# EAGLE design Beta24_SMD (EAGLE 9.4.2)
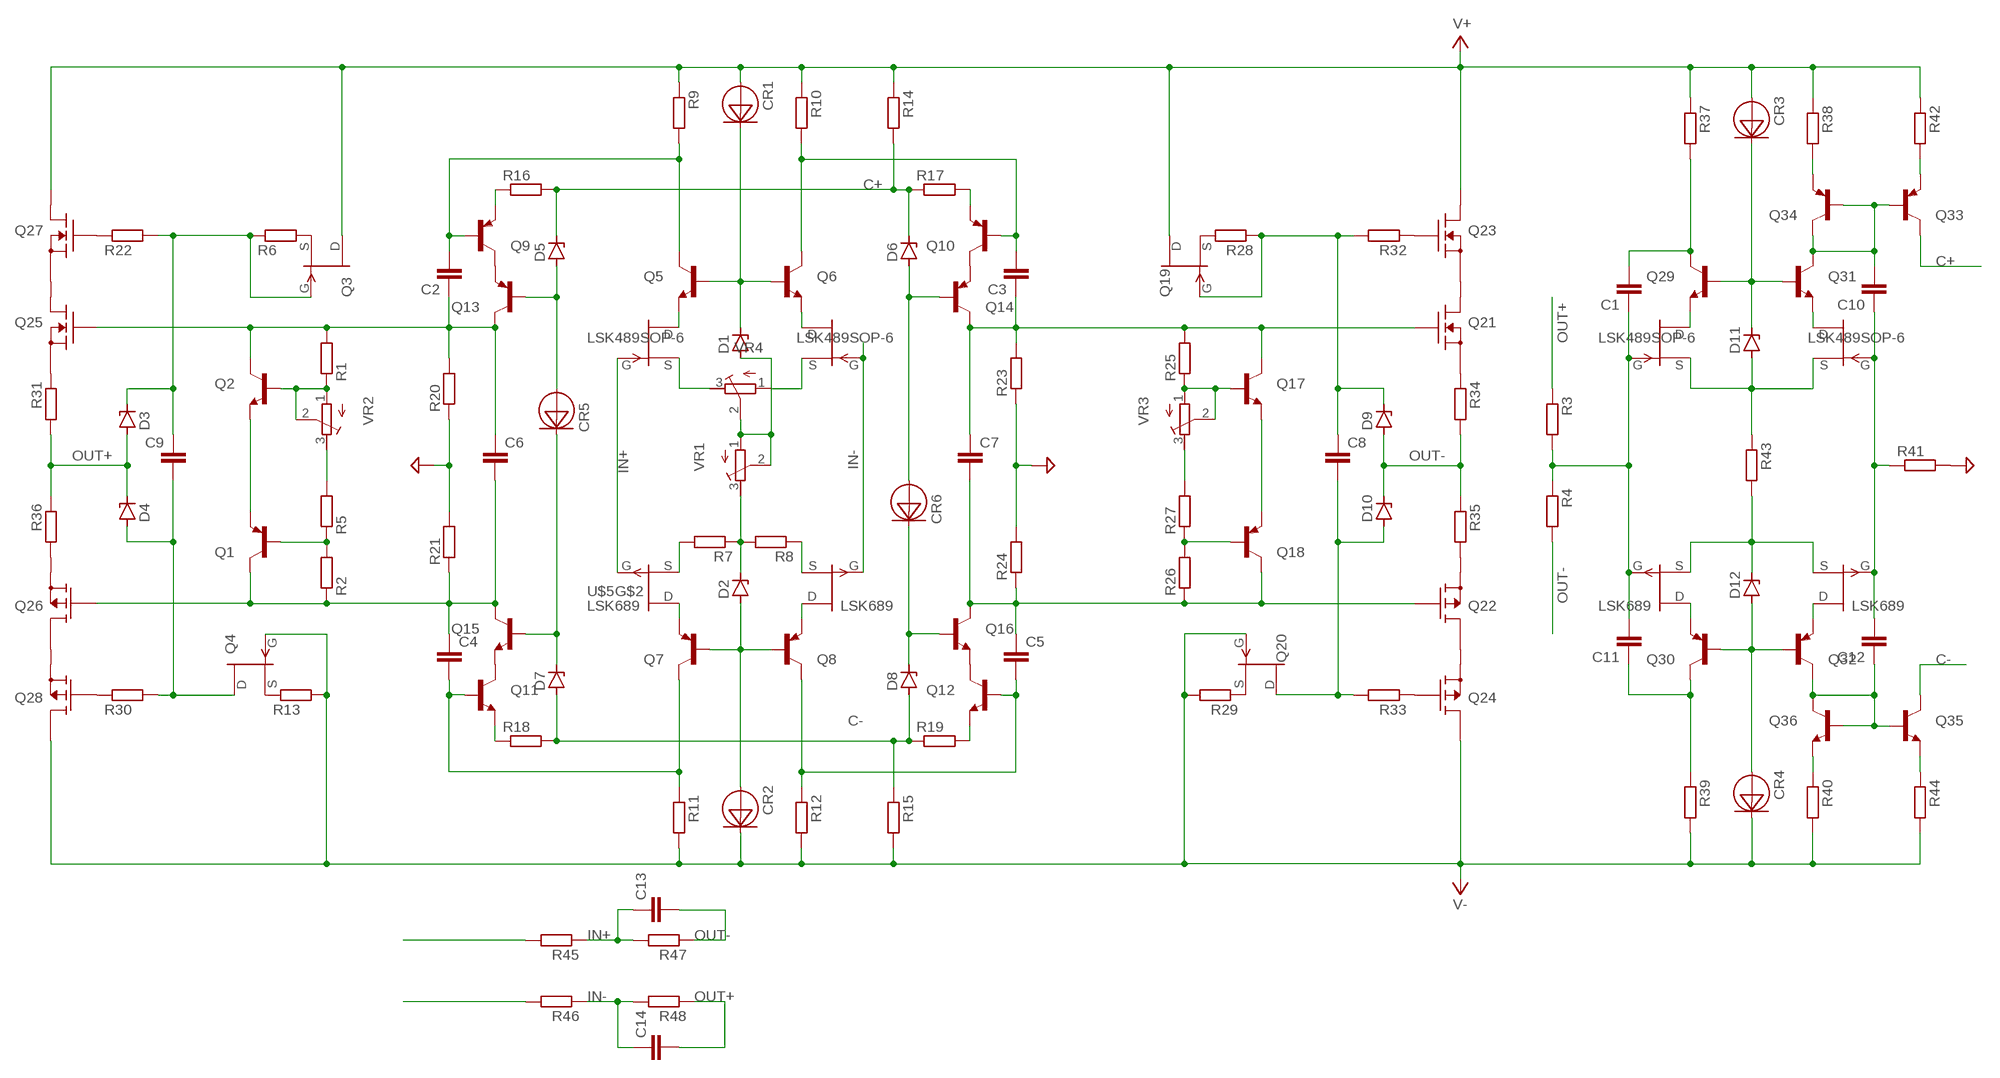
[diagram p0: schematic, sheet 1]

## Parts
C1  C-EUC1206  [C1206]
C2  C-EUC1206  [C1206]
C3  C-EUC1206  [C1206]
C4  C-EUC1206  [C1206]
C5  C-EUC1206  [C1206]
C6  C-EUC1206  [C1206]
C7  C-EUC1206  [C1206]
C8  C-EUC1206  [C1206]
C9  C-EUC1206  [C1206]
C10  C-EUC1206  [C1206]
C11  C-EUC1206  [C1206]
C12  C-EUC1206  [C1206]
C13  C-EUC1206  [C1206]
C14  C-EUC1206  [C1206]
CR1  1N5283  [SMD]
CR2  1N5283  [SMD]
CR3  1N5283  [SMD]
CR4  1N5283  [SMD]
CR5  1N5283  [SMD]
CR6  1N5283  [SMD]
D1  ZENER-DIODESOD80C  [SOD80C]
D2  ZENER-DIODESOD80C  [SOD80C]
D3  ZENER-DIODESOD80C  [SOD80C]
D4  ZENER-DIODESOD80C  [SOD80C]
D5  ZENER-DIODESOD80C  [SOD80C]
D6  ZENER-DIODESOD80C  [SOD80C]
D7  ZENER-DIODESOD80C  [SOD80C]
D8  ZENER-DIODESOD80C  [SOD80C]
D9  ZENER-DIODESOD80C  [SOD80C]
D10  ZENER-DIODESOD80C  [SOD80C]
D11  ZENER-DIODESOD80C  [SOD80C]
D12  ZENER-DIODESOD80C  [SOD80C]
Q1  TRANSISTOR_BC858C-PNP-SOT23-BEC  [TRANSISTOR_SOT23-BEC]
Q2  TRANSISTOR_BC850-NPN-SOT23-BEC  [TRANSISTOR_SOT23-BEC]
Q3  SST5486  [SOT23]
Q4  SST5486  [SOT23]
Q5  TRANSISTOR_BC850-NPN-SOT23-BEC  [TRANSISTOR_SOT23-BEC]
Q6  TRANSISTOR_BC850-NPN-SOT23-BEC  [TRANSISTOR_SOT23-BEC]
Q7  TRANSISTOR_BC858C-PNP-SOT23-BEC  [TRANSISTOR_SOT23-BEC]
Q8  TRANSISTOR_BC858C-PNP-SOT23-BEC  [TRANSISTOR_SOT23-BEC]
Q9  TRANSISTOR_BC858C-PNP-SOT23-BEC  [TRANSISTOR_SOT23-BEC]
Q10  TRANSISTOR_BC858C-PNP-SOT23-BEC  [TRANSISTOR_SOT23-BEC]
Q11  TRANSISTOR_BC850-NPN-SOT23-BEC  [TRANSISTOR_SOT23-BEC]
Q12  TRANSISTOR_BC850-NPN-SOT23-BEC  [TRANSISTOR_SOT23-BEC]
Q13  TRANSISTOR_BC858C-PNP-SOT23-BEC  [TRANSISTOR_SOT23-BEC]
Q14  TRANSISTOR_BC858C-PNP-SOT23-BEC  [TRANSISTOR_SOT23-BEC]
Q15  TRANSISTOR_BC850-NPN-SOT23-BEC  [TRANSISTOR_SOT23-BEC]
Q16  TRANSISTOR_BC850-NPN-SOT23-BEC  [TRANSISTOR_SOT23-BEC]
Q17  TRANSISTOR_BC850-NPN-SOT23-BEC  [TRANSISTOR_SOT23-BEC]
Q18  TRANSISTOR_BC858C-PNP-SOT23-BEC  [TRANSISTOR_SOT23-BEC]
Q19  SST5486  [SOT23]
Q20  SST5486  [SOT23]
Q21  IRFZ24N  [TO220V]
Q22  IRFZ34N  [TO220V]
Q23  IRFZ24N  [TO220V]
Q24  IRFZ34N  [TO220V]
Q25  IRFZ24N  [TO220V]
Q26  IRFZ34N  [TO220V]
Q27  IRFZ24N  [TO220V]
Q28  IRFZ34N  [TO220V]
Q29  TRANSISTOR_BC850-NPN-SOT23-BEC  [TRANSISTOR_SOT23-BEC]
Q30  TRANSISTOR_BC858C-PNP-SOT23-BEC  [TRANSISTOR_SOT23-BEC]
Q31  TRANSISTOR_BC850-NPN-SOT23-BEC  [TRANSISTOR_SOT23-BEC]
Q32  TRANSISTOR_BC858C-PNP-SOT23-BEC  [TRANSISTOR_SOT23-BEC]
Q33  TRANSISTOR_BC858C-PNP-SOT23-BEC  [TRANSISTOR_SOT23-BEC]
Q34  TRANSISTOR_BC858C-PNP-SOT23-BEC  [TRANSISTOR_SOT23-BEC]
Q35  TRANSISTOR_BC850-NPN-SOT23-BEC  [TRANSISTOR_SOT23-BEC]
Q36  TRANSISTOR_BC850-NPN-SOT23-BEC  [TRANSISTOR_SOT23-BEC]
R1  R-EU_MELF0204W  [MINI_MELF-0204W]
R2  R-EU_MELF0204W  [MINI_MELF-0204W]
R3  R-EU_MELF0204W  [MINI_MELF-0204W]
R4  R-EU_MELF0204W  [MINI_MELF-0204W]
R5  R-EU_MELF0204W  [MINI_MELF-0204W]
R6  R-EU_MELF0204W  [MINI_MELF-0204W]
R7  R-EU_MELF0204W  [MINI_MELF-0204W]
R8  R-EU_MELF0204W  [MINI_MELF-0204W]
R9  R-EU_MELF0204W  [MINI_MELF-0204W]
R10  R-EU_MELF0204W  [MINI_MELF-0204W]
R11  R-EU_MELF0204W  [MINI_MELF-0204W]
R12  R-EU_MELF0204W  [MINI_MELF-0204W]
R13  R-EU_MELF0204W  [MINI_MELF-0204W]
R14  R-EU_MELF0204W  [MINI_MELF-0204W]
R15  R-EU_MELF0204W  [MINI_MELF-0204W]
R16  R-EU_MELF0204W  [MINI_MELF-0204W]
R17  R-EU_MELF0204W  [MINI_MELF-0204W]
R18  R-EU_MELF0204W  [MINI_MELF-0204W]
R19  R-EU_MELF0204W  [MINI_MELF-0204W]
R20  R-EU_MELF0204W  [MINI_MELF-0204W]
R21  R-EU_MELF0204W  [MINI_MELF-0204W]
R22  R-EU_MELF0204W  [MINI_MELF-0204W]
R23  R-EU_MELF0204W  [MINI_MELF-0204W]
R24  R-EU_MELF0204W  [MINI_MELF-0204W]
R25  R-EU_MELF0204W  [MINI_MELF-0204W]
R26  R-EU_MELF0204W  [MINI_MELF-0204W]
R27  R-EU_MELF0204W  [MINI_MELF-0204W]
R28  R-EU_MELF0204W  [MINI_MELF-0204W]
R29  R-EU_MELF0204W  [MINI_MELF-0204W]
R30  R-EU_MELF0204W  [MINI_MELF-0204W]
R31  R-EU_0617/17  [0617/17]
R32  R-EU_MELF0204W  [MINI_MELF-0204W]
R33  R-EU_MELF0204W  [MINI_MELF-0204W]
R34  R-EU_0617/17  [0617/17]
R35  R-EU_0617/17  [0617/17]
R36  R-EU_0617/17  [0617/17]
R37  R-EU_MELF0204W  [MINI_MELF-0204W]
R38  R-EU_MELF0204W  [MINI_MELF-0204W]
R39  R-EU_MELF0204W  [MINI_MELF-0204W]
R40  R-EU_MELF0204W  [MINI_MELF-0204W]
R41  R-EU_MELF0204W  [MINI_MELF-0204W]
R42  R-EU_MELF0204W  [MINI_MELF-0204W]
R43  R-EU_MELF0204W  [MINI_MELF-0204W]
R44  R-EU_MELF0204W  [MINI_MELF-0204W]
R45  R-EU_MELF0204W  [MINI_MELF-0204W]
R46  R-EU_MELF0204W  [MINI_MELF-0204W]
R47  R-EU_MELF0204W  [MINI_MELF-0204W]
R48  R-EU_MELF0204W  [MINI_MELF-0204W]
U$1  LSK489SOP-6  [SOT-23-6]
U$3  LSK489SOP-6  [SOT-23-6]
U$4  LSK689  [SOT-23-6]
U$5  LSK689  [SOT-23-6]
VR1  R-TRIMM3296W  [RTRIM3296W]
VR2  R-TRIMM3296W  [RTRIM3296W]
VR3  R-TRIMM3296W  [RTRIM3296W]
VR4  R-TRIMM3296W  [RTRIM3296W]

## Nets
C+: D5.C D6.C Q33.C R14.2 R16.2 R17.1
C-: D7.A D8.A Q35.C R15.1 R18.2 R19.1
GND: R20.1 R21.2 R23.1 R24.2 R41.2
IN+: C13.1 R45.1 R47.2 U$1.1(G) U$5.4(G)
IN-: C14.1 R46.1 R48.2 U$1.4(G) U$5.1(G)
N$1: C12.1 Q32.C Q35.B Q36.B Q36.C
N$2: Q6.E U$1.5(D)
N$3: U$1.3(S) VR4.3(E)
N$4: R7.2 U$5.6(S)
N$5: Q5.E U$1.2(D)
N$6: Q7.E U$5.5(D)
N$7: U$1.6(S) VR4.1(A)
N$8: D2.C R7.1 R8.2 VR1.3(E)
N$9: R8.1 U$5.3(S)
N$10: Q8.E U$5.2(D)
N$11: D1.A VR1.1(A) VR1.2(S) VR4.2(S)
N$12: CR2.ANODE D2.A Q7.B Q8.B
N$13: C2.2 Q5.C Q9.B R9.2
N$14: C3.2 Q6.C Q10.B R10.2
N$15: C3.1 C7.1 Q14.C Q17.C Q21.1(G) R23.2 R25.2
N$16: CR1.CATHODE D1.C Q5.B Q6.B
N$17: Q36.E R40.1
N$18: C5.2 Q8.C Q12.B R12.1
N$19: C1.1 C11.2 R3.2 R4.1 U$3.1(G) U$4.1(G)
N$20: C8.2 D10.A Q20.1(D) R33.2
N$21: D12.C R43.2 U$4.3(S) U$4.6(S)
N$22: D11.A R43.1 U$3.3(S) U$3.6(S)
N$23: Q9.C Q13.E
N$24: C4.2 Q7.C Q11.B R11.1
N$25: Q10.C Q14.E
N$26: Q34.E R38.2
N$27: Q9.E R16.1
N$28: Q10.E R17.2
N$29: C10.2 Q31.C Q33.B Q34.B Q34.C
N$30: Q11.E R18.1
N$31: Q12.E R19.2
N$32: R45.2
N$33: Q31.E U$3.5(D)
N$34: CR4.ANODE D12.A Q30.B Q32.B
N$35: C2.1 C6.1 Q2.C Q13.C Q25.1(G) R1.2 R20.2
N$36: C4.1 C6.2 Q1.C Q15.C Q26.1(G) R2.1 R21.1
N$37: Q11.C Q15.E
N$38: Q12.C Q16.E
N$39: Q17.B R25.1 VR3.1(A) VR3.2(S)
N$40: Q19.2(S) R28.2
N$41: Q20.2(S) R29.1
N$42: C1.2 Q29.C R37.2
N$43: CR5.ANODE D5.A Q13.B
N$44: CR6.ANODE D6.A Q14.B
N$45: CR5.CATHODE D7.C Q15.B
N$46: CR6.CATHODE D8.C Q16.B
N$47: Q18.B R26.2 R27.1
N$48: R27.2 VR3.3(E)
N$49: Q17.E Q18.E
N$50: C5.1 C7.2 Q16.C Q18.C Q22.1(G) R24.1 R26.1
N$51: Q1.B R2.2 R5.1
N$52: Q1.E Q2.E
N$53: Q35.E R44.1
N$54: C8.1 D9.C Q19.3(G) R28.1 R32.2
N$55: Q3.2(S) R6.2
N$56: Q4.2(S) R13.1
N$57: Q21.2(D) Q23.3(S)
N$58: Q22.2(D) Q24.3(S)
N$59: Q23.1(G) R32.1
N$60: Q24.1(G) R33.1
N$61: C9.1 D3.C Q3.3(G) R6.1 R22.2
N$62: Q21.3(S) R34.1
N$63: Q22.3(S) R35.2
N$64: C9.2 D4.A Q4.1(D) R30.2
N$65: Q25.2(D) Q27.3(S)
N$66: Q26.2(D) Q28.3(S)
N$67: Q27.1(G) R22.1
N$68: Q28.1(G) R30.1
N$69: Q25.3(S) R31.1
N$70: Q26.3(S) R36.2
N$71: Q2.B R1.1 VR2.1(A) VR2.2(S)
N$72: R5.2 VR2.3(E)
N$73: CR3.CATHODE D11.C Q29.B Q31.B
N$75: Q29.E U$3.2(D)
N$76: C10.1 C12.2 R41.1 U$3.4(G) U$4.4(G)
N$77: Q30.E U$4.2(D)
N$79: Q32.E U$4.5(D)
N$80: C11.1 Q30.C R39.1
N$81: Q33.E R42.2
N$82: R46.2
OUT+: C14.2 D3.A D4.C R3.1 R31.2 R36.1 R48.1
OUT-: C13.2 D9.A D10.C R4.2 R34.2 R35.1 R47.1
V+: CR1.ANODE CR3.ANODE Q3.1(D) Q19.1(D) Q23.2(D) Q27.2(D) R9.1 R10.1 R14.1 R37.1 R38.1 R42.1
V-: CR2.CATHODE CR4.CATHODE Q4.3(G) Q20.3(G) Q24.2(D) Q28.2(D) R11.2 R12.2 R13.2 R15.2 R29.2 R39.2 R40.2 R44.2

## Library data of the parts
C1-C14 = Vwvwbg:C-EU: CAPACITOR, European symbol
CR1-CR6 = crd:1N5283: 0.22 mA through 4.23 mA current regulating diode series
D1-D12 = diode:ZENER-DIODE: Z-Diode
Q1 Q7-Q10 Q13 Q14 Q18 Q30 Q32-Q34 = Vwvwbg:TRANSISTOR_*-PNP-: PNP Transistror
Q2 Q5 Q6 Q11 Q12 Q15-Q17 Q29 Q31 Q35 Q36 = Vwvwbg:TRANSISTOR_*-NPN-: NPN Transistror BF959 corrected 2008.03.06
Q3 Q4 Q19 Q20 = transistor-fet:?548*: N-Channel JFETs Source: VISHAY 2N5484.pdf Compatible: TO92 2N5245 J304 J305 U310 J308 J309 J310 TO72 2N4416 2N4416A 2N3823 2N4351 3N169 3N170 3N171 MFE3002 TO18 2N3796 2N3797 MFE825 Source: Motorola European Master Guide Pacge 3-59
Q21 Q23 Q25 Q27 = transistor-fet:IRFZ24N
Q22 Q24 Q26 Q28 = transistor-fet:IRFZ34N
R1-R48 = Vwvwbg:R-EU_: RESISTOR, European symbol
U$1 U$3 = Vwvwbg:LSK489
U$4 U$5 = Vwvwbg:LSK689
VR1-VR4 = resistor:R-TRIMM: Trimm resistor

## Board
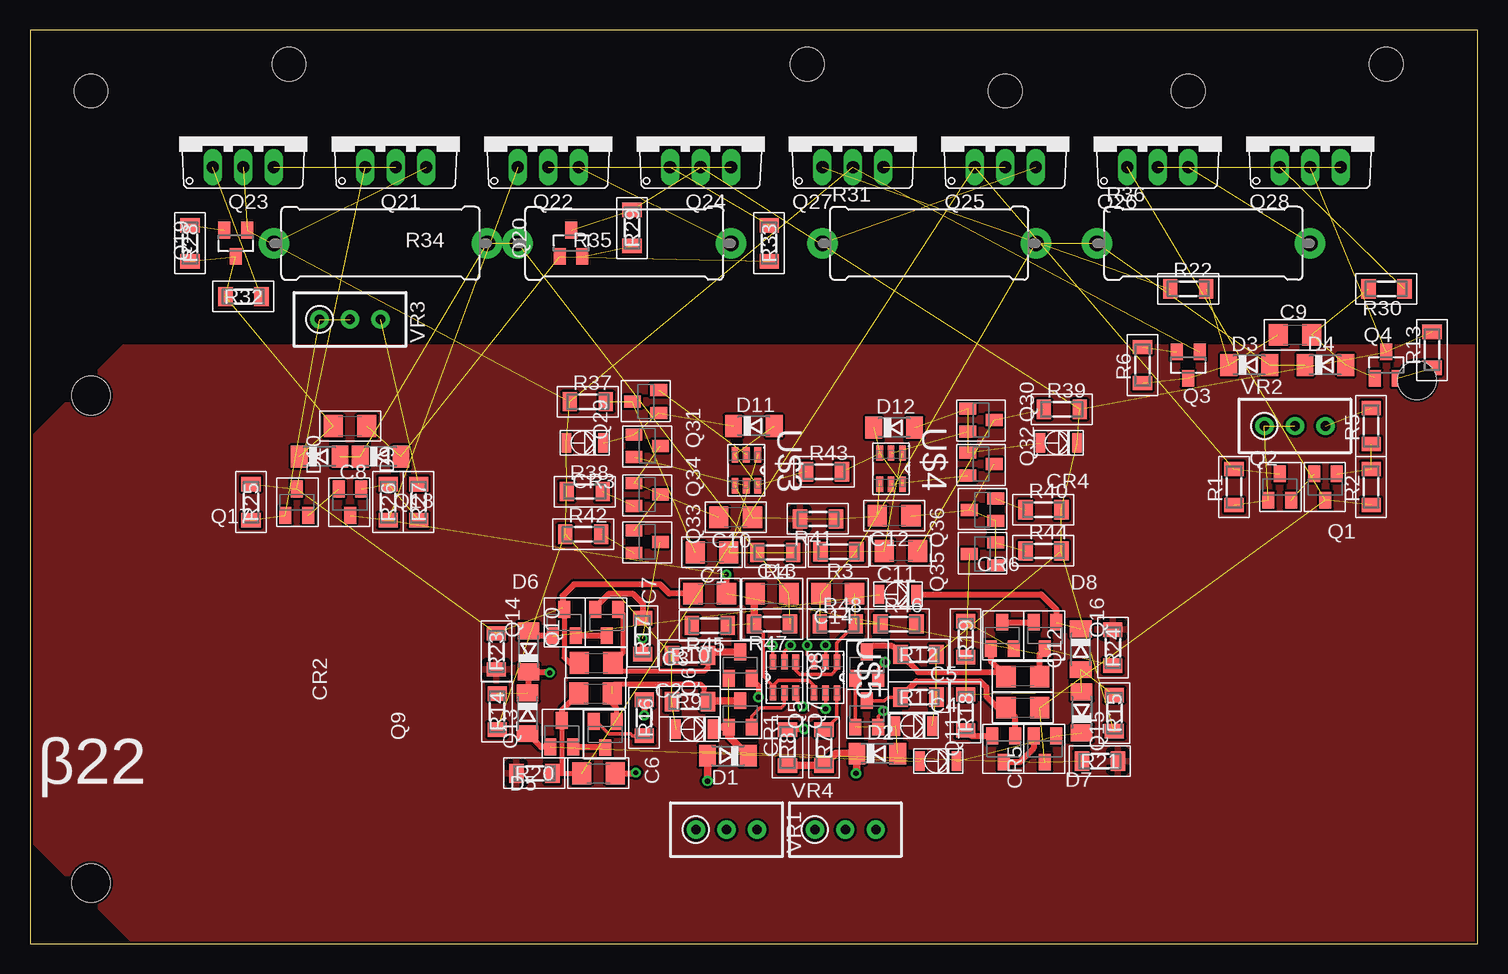
[diagram p1: board, top side]
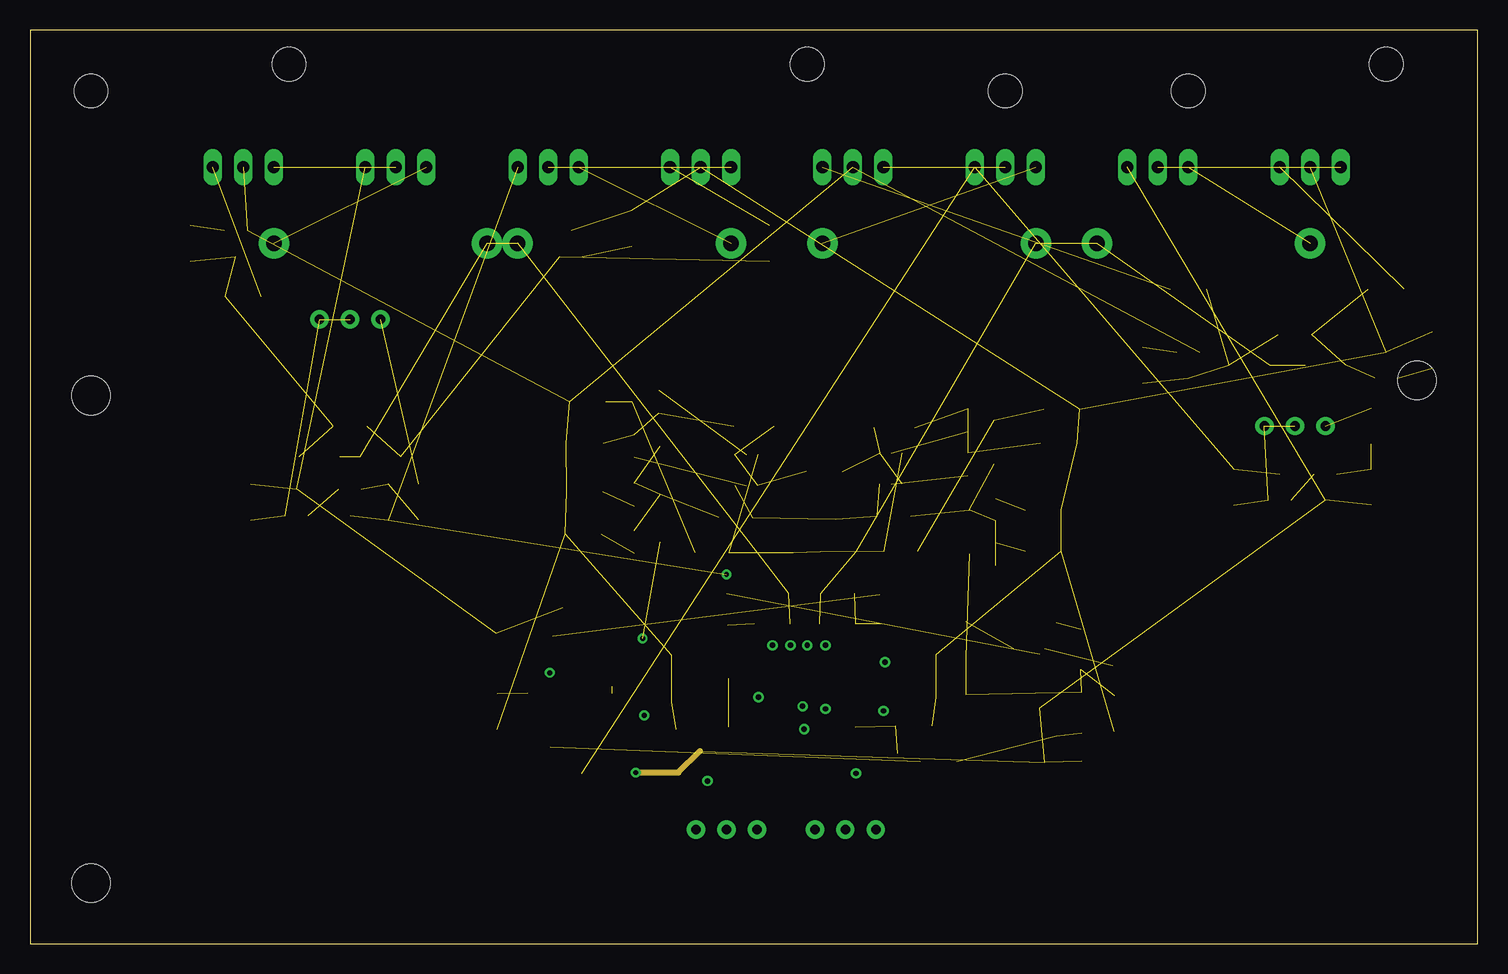
[diagram p2: board, inner layer Route2]
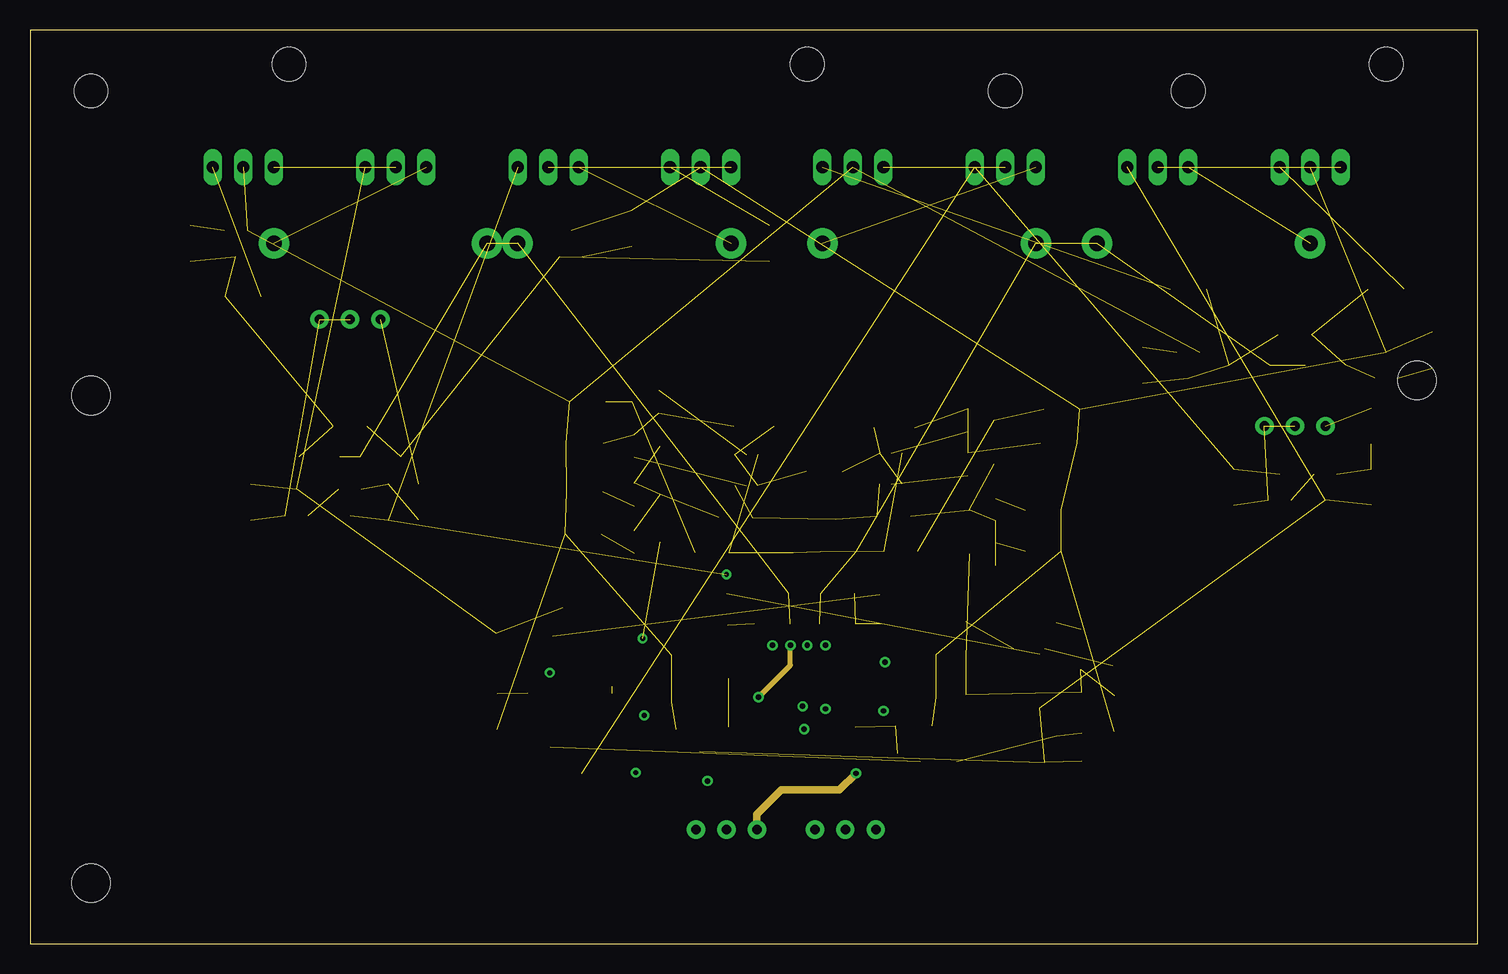
[diagram p3: board, inner layer Route15]
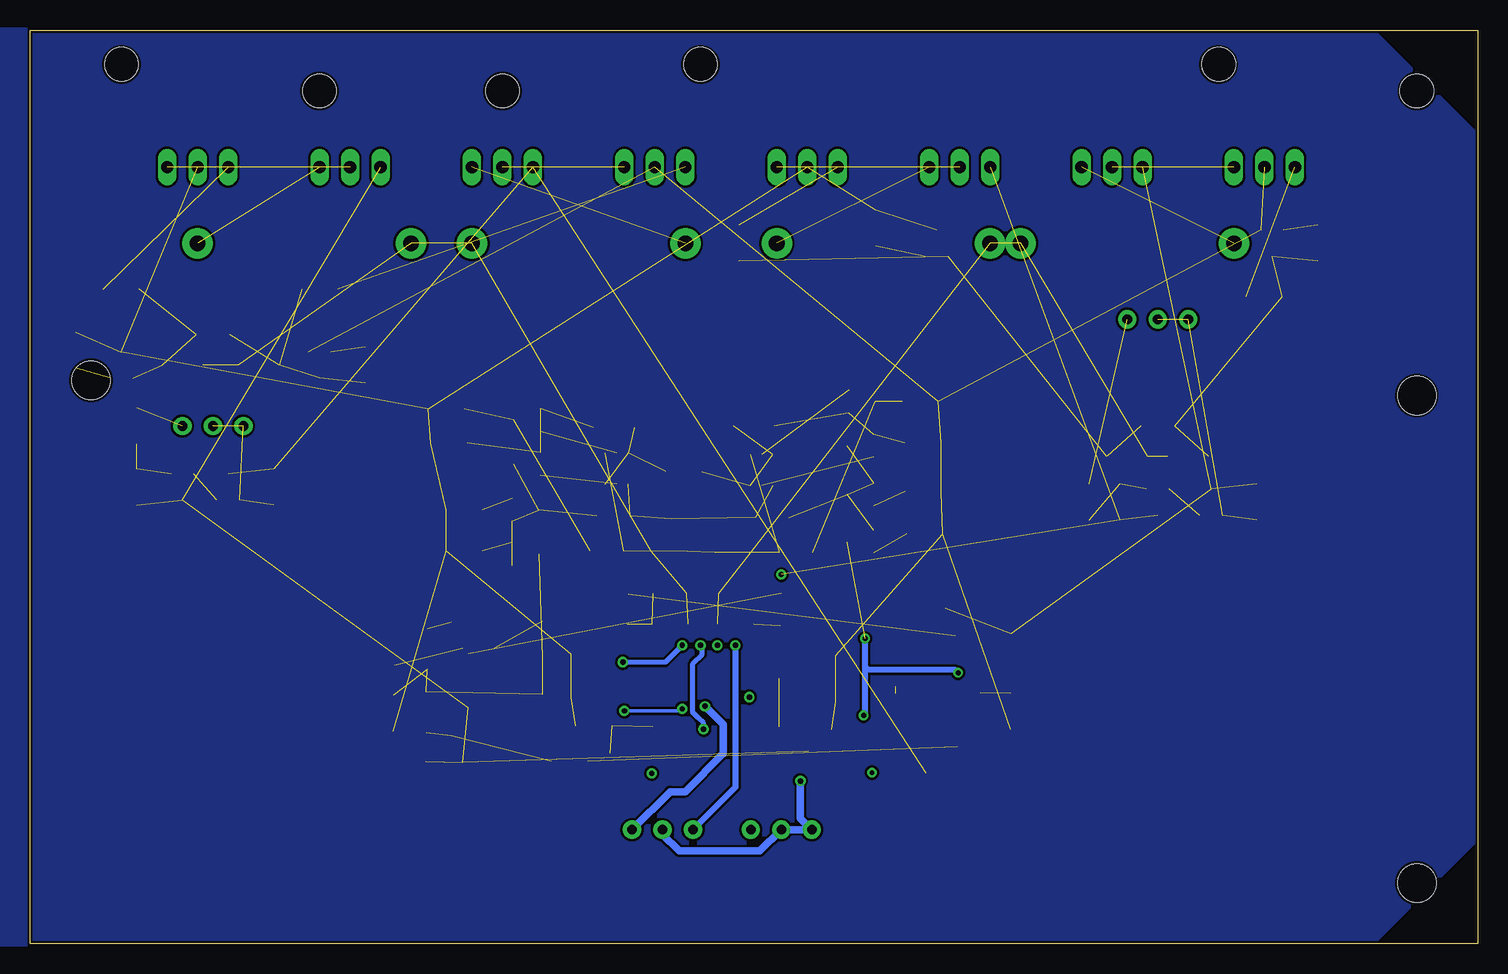
[diagram p4: board, bottom side, seen from below]

Size 120.65 x 76.2 mm. Coordinates in mm from the lower left corner, seen from the top.
Outline: 0,0 120.65,0 120.65,76.2 0,76.2 0,0
Copper layers (1+2*15+16): Top 0.035mm / dielectric 1.5mm / Route2 0.035mm / dielectric 0.15mm / Route15 0.035mm / dielectric 0.2mm / Bottom 0.035mm
Design rules "default *": minimum track width 10mil, minimum drill 0.4mm, track to track 8mil, track to pad 8mil, pad to pad 8mil, via to via 8mil, smd to smd 8mil, copper to edge 8mil, drill to drill 8mil, minimum pad ring 10mil, minimum via ring 8mil, stop-mask expansion 4mil, vias tented up to drill 0mil, thermal gap 15mil
Holes 3.2 mm at 5.08,5.08 172.72,5.08 5.08,45.72 115.57,46.99
Holes 2.8 mm at 5.08,71.12 21.59,73.34 64.77,73.34 113.03,73.34 156.21,73.34 172.72,71.12 81.28,71.12 96.52,71.12

### Footprints (pad centres in the part's own frame; a part is rotated, then mirrored left to right if it is on the bottom)
C1206 = smd 1.6 x 1.8: 1 -1.4,0; 2 1.4,0
SMD = smd 0.8 x 1.6: ANODE 1.525,0; CATHODE -1.525,0
SOD80C = smd 1.4 x 1.8: A 1.7,0; C -1.7,0
TRANSISTOR_SOT23-BEC = smd 1 x 1.4: B -0.95,-1.1; C 0,1.1; E 0.95,-1.1
SOT23 = smd 1 x 1.4: 1 -0.95,-1.1; 2 0.95,-1.1; 3 0,1.1
TO220V = drill 1.016 long: 1 -2.54,-2.54; 2 0,-2.54; 3 2.54,-2.54
MINI_MELF-0204W = smd 1.2 x 1.6: 1 -1.5,0; 2 1.5,0
0617/17 = drill 1.3 pad 2.54: 1 -8.89,0; 2 8.89,0
SOT-23-6 = smd 1.27 x 0.559: 1 -1.295,0.95; 2 -1.295,0; 3 -1.295,-0.95; 4 1.295,-0.95; 5 1.295,0; 6 1.295,0.95
RTRIM3296W = drill 0.8 pad 1.524: 1 0,-2.54; 2 0,0; 3 0,2.54

### Placement (x,y rotation side)
C1  56.83,32.64 180 top
C2  47.12,20.89 0 top
C3  47.18,23.43 0 top
C4  82.74,19.68 180 top
C5  82.74,22.29 180 top
C6  47.37,14.22 0 top
C7  56.64,29.21 0 top
C8  26.67,43.18 0 top
C9  105.41,50.8 0 top
C10  58.8,35.56 180 top
C11  72.58,32.77 180 top
C12  72.01,35.69 180 top
C13  61.85,29.21 0 top
C14  67.31,29.21 180 top
CR1  55.37,17.91 180 top
CR2  73.66,18.16 180 top
CR3  46.23,41.78 180 top
CR4  85.72,41.78 180 top
CR5  75.69,15.24 180 top
CR6  72.33,29.15 180 top
D1  58.17,15.68 180 top
D2  70.61,15.88 0 top
D3  101.6,48.26 0 top
D4  107.95,48.26 0 top
D5  41.47,19.24 270 top
D6  41.53,24.38 90 top
D7  87.63,19.3 90 top
D8  87.57,24.57 270 top
D9  24.13,40.64 0 top
D10  29.21,40.64 0 top
D11  60.33,43.18 0 top
D12  72.01,43.05 0 top
Q1  107.95,38.1 180 top
Q2  104.14,38.1 0 top
Q3  96.52,48.26 180 top
Q4  113.03,48.26 0 top
Q5  59.18,19.18 0 top
Q6  59.18,23.24 0 top
Q7  69.72,19.18 0 top
Q8  69.72,23.24 0 top
Q9  47.94,17.46 180 top
Q10  48.07,26.8 180 top
Q11  81.15,16.26 180 top
Q12  81.03,25.72 0 top
Q13  44.32,17.53 0 top
Q14  44.51,26.8 0 top
Q15  84.58,16.26 180 top
Q16  84.58,25.72 180 top
Q17  22.23,36.83 0 top
Q18  26.67,36.83 180 top
Q19  17.14,58.42 180 top
Q20  45.09,58.42 0 top
Q21  30.48,67.31 0 top
Q22  43.18,67.31 0 top
Q23  17.78,67.31 0 top
Q24  55.88,67.31 0 top
Q25  81.28,67.31 0 top
Q26  93.98,67.31 0 top
Q27  68.58,67.31 0 top
Q28  106.68,67.31 0 top
Q29  51.31,45.21 90 top
Q30  79.25,43.69 270 top
Q31  51.44,41.53 270 top
Q32  79.25,40.01 270 top
Q33  51.44,33.53 270 top
Q34  51.44,37.47 270 top
Q35  79.38,32.51 90 top
Q36  79.38,36.2 90 top
R1  100.33,38.1 90 top
R2  111.76,38.1 90 top
R3  67.37,32.7 180 top
R4  62.1,32.64 180 top
R5  111.76,43.18 90 top
R6  92.71,48.26 90 top
R7  66.17,16.38 90 top
R8  63.12,16.38 270 top
R9  54.99,20.19 0 top
R10  54.99,24.07 0 top
R11  74.04,20.57 0 top
R12  74.04,24.13 0 top
R13  116.84,49.53 90 top
R14  38.93,19.37 90 top
R15  90.36,19.24 270 top
R16  51.18,18.86 90 top
R17  51.05,25.65 90 top
R18  77.98,19.3 90 top
R19  77.98,25.4 90 top
R20  42.04,14.22 0 top
R21  89.15,15.24 0 top
R22  96.52,54.61 0 top
R23  38.86,24.38 90 top
R24  90.23,24.7 90 top
R25  18.41,36.83 90 top
R26  29.84,36.83 90 top
R27  32.38,36.83 90 top
R28  13.34,58.42 90 top
R29  50.16,59.69 90 top
R30  113.03,54.61 180 top
R31  74.93,58.42 0 top
R32  17.78,53.98 180 top
R33  61.59,58.42 270 top
R34  29.21,58.42 0 top
R35  49.53,58.42 0 top
R36  97.79,58.42 0 top
R37  46.48,45.21 0 top
R38  46.23,37.72 0 top
R39  85.98,44.58 0 top
R40  84.45,36.2 0 top
R41  65.66,35.43 180 top
R42  46.1,34.16 0 top
R43  66.17,39.37 0 top
R44  84.45,32.77 0 top
R45  56.64,26.54 180 top
R46  72.39,26.67 0 top
R47  61.85,26.67 180 top
R48  67.31,26.67 0 top
U$1  62.87,22.23 90 top
U$3  59.69,39.5 270 top
U$4  71.75,39.62 270 top
U$5  66.29,22.23 270 top
VR1  58.04,9.53 270 top
VR2  105.41,43.18 270 top
VR3  26.67,52.07 270 top
VR4  67.94,9.53 270 top

### Tracks (layer width: path | path; a pad name or v marks a point on that pad's centre or on a via)
C+  (via drill 0.4)  (2 unrouted)
  Top 0.508: D5.C 41.53,21 D6.C 43.23,22.68 v43.31,22.61 | R17.1 v51.05,25.46 | R16.2 v51.18,19.05
  Bottom 0.508: v43.31,22.61 43.56,22.86 50.8,22.86 51.05,23.11 v51.05,25.46 51.05,19.18 v51.18,19.05
C-  (5 unrouted)
GND
  pour Bottom: 0,8.89 8.89,0 168.91,0 168.91,67.51 160.22,76.2 8.89,76.2 0,67.31
  pour Top: 7.82,49.73 0,41.91 0,8.89 8.89,0 168.91,0 168.91,42.11 161.29,49.73
IN+  (1 unrouted)
  Top 0.254: 65.34,21.27 U$5.4
  Top 0.305: U$5.4 65.34,21.52 64.9,21.97 62.36,21.97 61.91,21.53 U$1.1 61.91,21.52 61.09,22.35 61.09,25.93 R47.2
  Top 0.61: R47.2 60.35,29.11 C13.1
IN-  (2 unrouted)
  Top 0.305: U$1.4 63.75,23.46 63.75,22.86 64.14,22.48 66.8,22.48 67.24,22.92 U$5.1 67.24,25.1 R48.2
N$1  (4 unrouted)
N$2  (via drill 0.45)
  Top 0.305: U$1.5 62.87,24.38 v63.37,24.89
  Top 0.406: Q6.E 60.71,21.57 v60.71,20.57
  Route15 0.406: v60.71,20.57 63.37,23.24 v63.37,24.89
N$3  (via drill 0.45)
  Top 0.305: U$1.3 63.81,20.39 v64.39,19.81
  Bottom 0.61: VR4.3 67.31,12.7 66.04,12.7 62.87,15.88 62.87,18.29 v64.39,19.81
N$4
  Top 0.305: U$5.6 67.24,18.82 R7.2
N$5
  Top 0.305: U$1.2 62.87,19.94 62.61,19.68 60.83,19.68 60.13,18.98 Q5.E
N$6  (via drill 0.45)
  Top 0.305: U$5.5 v66.29,19.59 | Q7.E 70.67,18.98 v71.12,19.43
  Bottom 0.305: v71.12,19.43 66.45,19.43 v66.29,19.59
N$7  (via drill 0.45)
  Top 0.305: U$1.6 61.91,24.85 v61.87,24.89
  Bottom 0.508: 65.41,9.65 VR4.1 61.87,13.06 v61.87,24.89
N$8  (via drill 0.45)
  Top 0.61: R8.2 R7.1 67.16,15.88 D2.C 68.91,14.3 v68.83,14.22
  Route15 0.61: v68.83,14.22 67.44,12.83 62.61,12.83 60.58,10.79 VR1.3
N$9  (via drill 0.45)
  Top 0.305: U$5.3 64.77,24.09 v64.77,24.89
  Top 0.406: R8.1 63.14,17.91 v64.52,17.91
  Bottom 0.406: v64.52,17.91 64.52,18.41 64.96,18.86 65.28,19.18 65.41,19.3 65.41,23.37 64.64,24.13 64.64,24.77 v64.77,24.89
N$10  (via drill 0.45)
  Top 0.305: U$5.2 v66.29,24.89 | Q8.E 70.67,22.92 v71.25,23.5
  Bottom 0.406: v71.25,23.5 67.69,23.5 v66.29,24.89
N$11  (via drill 0.45)
  Top 0.61: D1.A 56.47,13.6 v56.45,13.59
  Bottom 0.61: VR4.2 67.94,9.14 66.55,7.75 59.82,7.75 VR1.2 VR1.1 56.45,10.48 v56.45,13.59
N$12  (2 unrouted)
  Top 0.305: Q7.B Q8.B
N$13  (1 unrouted)
  Top 0.406: R9.2 56.2,20.49 56.2,21.34 55.88,21.65 48.7,21.65 48.51,21.46 | Q9.B 48.89,19.69 48.26,20.32 48.26,20.63 C2.2
  Top 0.61: Q5.C 56.58,20.28 R9.2
N$14
  Top 0.406: R10.2 56.49,23.03 56.2,22.73 49.28,22.73 C3.2 49.4,24.25 49.4,27.51 Q10.B
  Top 0.61: Q6.C 56.77,24.34 R10.2
N$15  (4 unrouted)
  Top 0.406: Q14.C 44.51,23.88 45.09,23.3 45.65,23.3 C3.1
  Top 0.508: C7.1 53.28,29.21 52.51,29.97 45.34,29.97 44.39,29.02 44.39,28.02 Q14.C
N$16  (1 unrouted)
  Top 0.61: D1.C 58.23,17.32 Q5.B 57.07,18.08 CR1.CATHODE
N$17  (1 unrouted)
N$18
  Top 0.508: Q8.C 70.21,24.83 71.84,24.83 R12.1 74,22.67 80.96,22.67 | 80.96,22.67 81.03,22.61 C5.2 | Q12.B 80.08,23.55 80.96,22.67
N$19  (5 unrouted)
N$20  (3 unrouted)
N$21  (3 unrouted)
N$22  (3 unrouted)
N$23
  Top 0.508: Q13.E 47.88,16.43 Q9.C
N$24
  Top 0.305: R11.1 71.5,20.57 71.2,20.28 Q7.C
  Top 0.508: 72.45,20.49 R11.1 73.87,21.91 79.18,21.91 79.69,21.4 79.69,20.64 80.64,19.68 C4.2 82.1,18.92 Q11.B
N$25
  Top 0.508: Q10.C Q14.E
N$26  (1 unrouted)
N$27
  Top 0.305: Q9.E 47.19,18.56 48.24,17.51 50.06,17.51 50.2,17.36 R16.1
N$28
  Top 0.508: Q10.E 47.12,28.07 48.26,29.21 50.23,29.21 51.05,28.38 R17.2
N$29  (4 unrouted)
N$30
  Top 0.508: R18.1 78.43,17.36 Q11.E
N$31  (1 unrouted)
N$33  (1 unrouted)
N$34  (3 unrouted)
N$35  (3 unrouted)
  Top 0.406: R20.2 44.26,14.22 | 44.26,14.22 C6.1 | 44.26,14.22 44.32,14.29 Q13.C
  Top 0.508: C2.1 44.32,19.5 Q13.C
N$36  (via drill 0.4)  (6 unrouted)
  Top 0.508: C6.2 50.42,14.22 v50.48,14.29
  Route2 0.508: v50.48,14.29 54.04,14.29 55.82,16.07
N$37
  Top 0.508: Q15.E 83.63,16.32 82.47,15.16 Q11.C
N$38
  Top 0.508: Q12.C Q16.E
N$39  (3 unrouted)
N$40  (1 unrouted)
N$41  (1 unrouted)
N$42  (2 unrouted)
N$43  (1 unrouted)
  Top 0.508: Q13.B 42.58,16.43 D5.A
N$44  (1 unrouted)
  Top 0.508: Q14.B 41.92,25.7 D6.A
N$45  (2 unrouted)
N$46  (1 unrouted)
  Top 0.508: CR6.CATHODE 84.26,29.15 85.53,27.88 Q16.B
N$47  (2 unrouted)
N$48  (1 unrouted)
N$49  (1 unrouted)
N$50  (via drill 0.4)  (5 unrouted)
  Top 0.508: C7.2 v58.04,30.79 v58.04,30.8 | C5.1 84.14,24.18 Q16.C
N$51  (2 unrouted)
N$52  (1 unrouted)
N$53  (1 unrouted)
N$54  (4 unrouted)
N$55  (1 unrouted)
N$56  (1 unrouted)
N$57  (1 unrouted)
N$58  (1 unrouted)
N$59  (1 unrouted)
N$60  (1 unrouted)
N$61  (4 unrouted)
N$62  (1 unrouted)
N$63  (1 unrouted)
N$64  (3 unrouted)
N$65  (1 unrouted)
N$66  (1 unrouted)
N$67  (1 unrouted)
N$68  (1 unrouted)
N$69  (1 unrouted)
N$70  (1 unrouted)
N$71  (3 unrouted)
N$72  (1 unrouted)
N$73  (3 unrouted)
N$75  (1 unrouted)
N$76  (4 unrouted)
N$77  (1 unrouted)
N$79  (1 unrouted)
N$80  (2 unrouted)
N$81  (1 unrouted)
OUT+  (6 unrouted)
OUT-  (6 unrouted)
V+  (11 unrouted)
V-  (13 unrouted)

### Text on the board
tPlace: β22